# Altium schematic sheet SchematicV2.SchDoc
size A; SheetNumber: 1; SheetTotal: 1
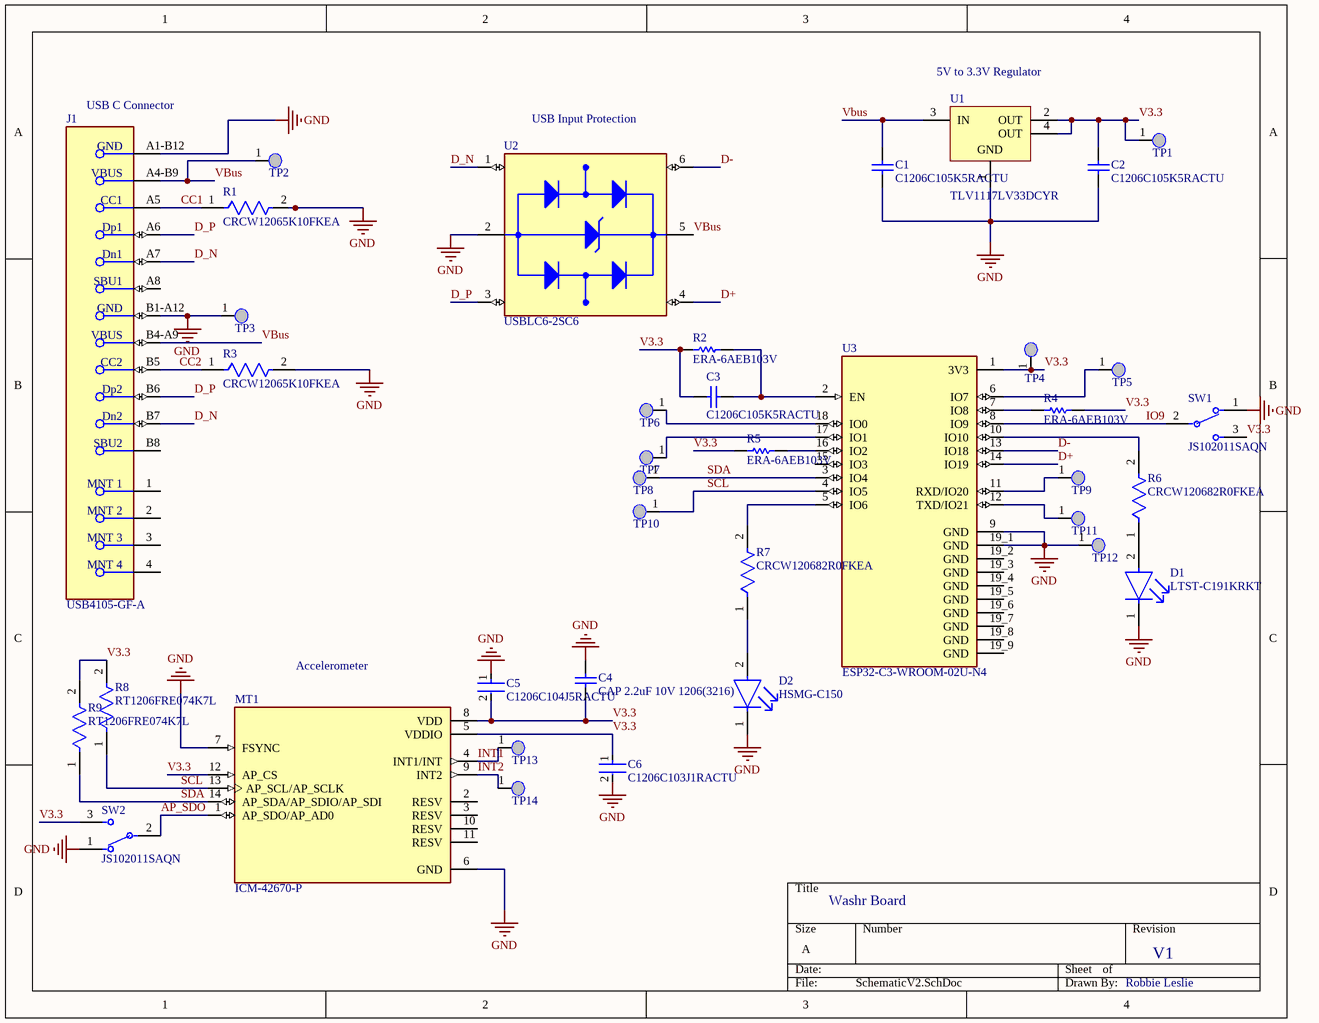
[diagram p0: SchematicV2.SchDoc]

## Parts
C1  C1206C105K5RACTU  [CAPC3216X110X50LL20T25]
C2  C1206C105K5RACTU  [CAPC3216X110X50LL20T25]
C3  C1206C105K5RACTU  [CAPC3216X110X50LL20T25]
C4  CAP 2.2uF 10V 1206(3216)  [CAPC1206(3216)110_M]
C5  C1206C104J5RACTU  [FP-C1206C-EB-MFG]
C6  C1206C103J1RACTU  [FP-C1206C-EB-MFG]
D1  LTST-C191KRKT  [FP-LTST-C191KRKT-MFG]
D2  HSMG-C150  [FP-HSMG-C150-MFG]
J1  USB4105-GF-A  [FP-USB4105-GF-A-MFG]
MT1  ICM-42670-P  [XDCR_ICM-42670-P]
R1  CRCW12065K10FKEA  [FP-CRCW1206-e3-IPC_C]
R2  ERA-6AEB103V  [RESC2013X60X40LL20T25_A]
R3  CRCW12065K10FKEA  [FP-CRCW1206-e3-IPC_C]
R4  ERA-6AEB103V  [RESC2013X60X40LL20T25_A]
R5  ERA-6AEB103V  [RESC2013X60X40LL20T25_A]
R6  CRCW120682R0FKEA  [FP-CRCW1206-e3-IPC_A]
R7  CRCW120682R0FKEA  [FP-CRCW1206-e3-IPC_A]
R8  RT1206FRE074K7L  [FP-RT1206-MFG]
R9  RT1206FRE074K7L  [FP-RT1206-MFG]
SW1  JS102011SAQN  [FP-JS102011SAQN-MFG]
SW2  JS102011SAQN  [FP-JS102011SAQN-MFG]
TP1  Testpin  [PCBComponent_1]  (value not drawn)  (no BOM)
TP2  Testpin  [PCBComponent_1]  (value not drawn)  (no BOM)
TP3  Testpin  [PCBComponent_1]  (value not drawn)  (no BOM)
TP4  Testpin  [PCBComponent_1]  (value not drawn)  (no BOM)
TP5  Testpin  [PCBComponent_1]  (value not drawn)  (no BOM)
TP6  Testpin  [PCBComponent_1]  (value not drawn)  (no BOM)
TP7  Testpin  [PCBComponent_1]  (value not drawn)  (no BOM)
TP8  Testpin  [PCBComponent_1]  (value not drawn)  (no BOM)
TP9  Testpin  [PCBComponent_1]  (value not drawn)  (no BOM)
TP10  Testpin  [PCBComponent_1]  (value not drawn)  (no BOM)
TP11  Testpin  [PCBComponent_1]  (value not drawn)  (no BOM)
TP12  Testpin  [PCBComponent_1]  (value not drawn)  (no BOM)
TP13  Testpin  [PCBComponent_1]  (value not drawn)  (no BOM)
TP14  Testpin  [PCBComponent_1]  (value not drawn)  (no BOM)
U1  TLV1117LV33DCYR  [DCY0004A_N]
U2  USBLC6-2SC6  [SOT95P280X145-6N]
U3  ESP32-C3-WROOM-02U-N4  [XCVR_ESP32-C3-WROOM-02U-N4]

## Nets
GND: C1.1 C2.1 C4.1 C5.1 C6.2 D1.1(C) D2.1(C) J1.A1-B12(GND) J1.B1-A12(GND) MT1.6(GND) MT1.7(FSYNC) R1.2 R3.2 SW1.1 SW2.1 TP3.1(TestPin) TP12.1(TestPin) U1.1(GND) U2.2(GND) U3.9(GND) U3.19_1(GND)
AP_SDO: MT1.1(AP_SDO/AP_AD0) SW2.2(C)
CC1: J1.A5(CC1) R1.1
CC2: J1.B5(CC2) R3.1
D+: U2.4(I/O2_OUT) U3.14(IO19)
D-: U2.6(I/O1_OUT) U3.13(IO18)
D_N: J1.A7(Dn1) J1.B7(Dn2) U2.1(I/O1_IN)
D_P: J1.A6(Dp1) J1.B6(Dp2) U2.3(I/O2_IN)
INT1: MT1.4(INT1/INT) TP13.1(TestPin)
INT2: MT1.9(INT2) TP14.1(TestPin)
IO9: SW1.2(C) U3.8(IO9)
SCL: MT1.13(AP_SCL/AP_SCLK) R8.1 TP10.1(TestPin) U3.4(IO5)
SDA: MT1.14(AP_SDA/AP_SDIO/AP_SDI) R9.1 TP8.1(TestPin) U3.3(IO4)
V3.3: C2.2 C3.2 C4.2 C5.2 C6.1 MT1.5(VDDIO) MT1.8(VDD) MT1.12(AP_CS) R2.1 R4.2 R5.2 R8.2 R9.2 SW1.3 SW2.3 TP1.1(TestPin) TP4.1(TestPin) U1.2(OUT) U1.4(OUT) U3.1(3V3)
VBus: C1.2 J1.A4-B9(VBUS) J1.B4-A9(VBUS) TP2.1(TestPin) U1.3(IN) U2.5(VBUS)
NetC3_1: C3.1 R2.2 U3.2(EN)
NetD1_2: D1.2(A) R6.1
NetD2_2: D2.2(A) R7.1
NetR4_1: R4.1 U3.7(IO8)
NetR5_1: R5.1 U3.16(IO2)
NetR6_2: R6.2 U3.10(IO10)
NetR7_2: R7.2 U3.5(IO6)
NetTP5_1: TP5.1(TestPin) U3.6(IO7)
NetTP6_1: TP6.1(TestPin) U3.18(IO0)
NetTP7_1: TP7.1(TestPin) U3.17(IO1)
NetTP9_1: TP9.1(TestPin) U3.11(RXD/IO20)
NetTP11_1: TP11.1(TestPin) U3.12(TXD/IO21)

Not connected (* = marked no-connect by the designer): J1 1(MNT_1) 2(MNT_2) 3(MNT_3) 4(MNT_4) A8(SBU1) B8(SBU2); MT1 2(RESV) 3(RESV) 10(RESV) 11(RESV); U3 15(IO3) 19_2(GND) 19_3(GND) 19_4(GND) 19_5(GND) 19_6(GND) 19_7(GND) 19_8(GND) 19_9(GND)

## Notes on the sheet
- (near U1) 5V to 3.3V Regulator
- (near J1) USB C Connector
- (near U2) USB Input Protection
- (near MT1) Accelerometer
- Washr Board
- V1
- Robbie Leslie

## Library data of the parts
C1-C3 = CMP-2000-06011-1: Chip Capacitor, 1 uF, +/- 10%, 50 V, -55 to 125 degC, 1206 (3216 Metric), RoHS, Tape and Reel; Manufacturer: Kemet; Case Height: 1mm; Dielectric: X7R; Voltage Rating: 50V; Capacitance: 1uF; Temperature Coefficient / Code: +/-15%; Case Length: 3.2mm; Case Width: 1.6mm; Type: SMDMLCCX7R6.3-250VDCCommericalGrade; Class: Class1; Capacitance - nF: 1000nF; Datasheet URL: http://www.kemet.com/docfinder?Partnumber=C1206C105K5RACTU; Product Category: MultilayerCeramicCapacitorsMLCC-SMD/SMT; Termination Style: SMD/SMT; Dimensions: 1.6mmWx3.2mmLx1mmH; Voltage Rating DC: 50V; Datasheet Version: 02/2016; Packaging: Reel; Brand: Kemet; RoHS: Details; Minimum Operating Temperature: -55C; Operating Temperature Range: -55Cto+125C; Package Reference: 1206; Manufacturer URL: http://www.kemet.com/; Product: GeneralTypeMLCCs; Tolerance: 10%; Package Description: 2-Pin Surface Mount Device, Body 3.2 x 1.6 mm; Mounting Technology: SurfaceMount; Case Code - mm: 3216; Maximum Operating Temperature: +125C; Series: C1206C; Factory Pack Quantity: 2500; Package / Case: 1206(3216metric); Case Code - in: 1206
C4 = CMP-1037-04796-1: CAP 2.2uF 10V ±10% 1206 (3216 Metric) Thickness 1.1mm SMD; Case-EIA: 1206; Tolerance: Â±10%; Case-Metric: 3216; Technology: SMT; Max Thickness: 1.1 mm; Rated Voltage: 10 V; Value: 2.2uF
C5 = CMP-03020-003996-1: Multilayer Ceramic Capacitor, C Series, 0.1 - F, - 5%, X7r, 50 V, 1206 [3216 Metric] Rohs Compliant: Yes; Manufacturer: KEMET; Capacitance: 0.10 μF; Automotive Grade: Grade 0; Voltage Rating: 50 V; Value: 0.10 μF; Description: C1206 0.10 μF X7R 5.00% 50 V; Temperature Coefficient: 15%; Tolerance: 0.05; Height: 0.88mm; Package: C1206C-EB; Octopart: https://octopart.com/c1206c104j5ractu-kemet-110335; Temperature Range Low: -55°C; Temperature: -55°C to +150°C; Manufacturer Part Number: C1206C104J5RACTU; ComponentLink2URL: https://content.kemet.com/datasheets/KEM_C1007_X8R_ULTRA_150C_SMD.pdf; Device Class L3: Ceramic Capacitors; ComponentLink2Description: Datasheet; Automotive: Yes; Material: Ceramic; Category: Cap; Temperature Range High: +150°C; Lead Free: Yes; RoHS: TRUE; Device Class L2: Capacitors; Temperature Characteristic: X7R; Digikey Description: Multilayer Ceramic Capacitor, C Series, 0.1 - F, - 5%, X7r, 50 V, 1206 [3216 Metric] Rohs Compliant: Yes; Mouser Description: Cap Ceramic 0.1uF 50V X7R 5% SMD 1206 125°C Plastic T/R; Ipc Land Pattern Name: CAPC320160X78; Device Class L1: Passive Components
C6 = CMP-03020-003656-1: CAP CER 10000PF 100V X7R 1206; Manufacturer: KEMET; Temperature Coefficient: 15%; Description: C1206 10,000 pF X7R 5.00% 100 V; Capacitance: 10,000 pF; Automotive Grade: Grade 0; Value: 10,000 pF; Material: Ceramic; Tolerance: 0.05; Digikey Description: CAP CER 10000PF 100V X7R 1206; Temperature Range Low: -55°C; Height: 0.88mm; Automotive: Yes; Ipc Land Pattern Name: CAPC320160X78; ComponentLink2URL: https://content.kemet.com/datasheets/KEM_C1007_X8R_ULTRA_150C_SMD.pdf; Device Class L2: Capacitors; Mouser Description: 1206 C 10nF Ceramic Multilayer Capacitor, 100 VDC, +125degC, X7R Dielec, +/-5%; Octopart: https://octopart.com/c1206c103j1ractu-kemet-121270; Category: Cap; Temperature Characteristic: X7R; Voltage Rating: 100 V; Temperature: -55°C to +150°C; Device Class L1: Passive Components; RoHS: TRUE; Device Class L3: Ceramic Capacitors; Manufacturer Part Number: C1206C103J1RACTU; Package: C1206C-EB; Lead Free: Yes; ComponentLink2Description: Datasheet; Temperature Range High: +150°C
D1 = CMP-2000-05199-2: NexarPartId: 549908; Illumination Color: Red; Lens Transparency: Clear; Luminous Intensity: 54mcd; Current: 2A; Forward Current: 20mA; Number of Elements: 1; Power Rating: 75mW; Lens Color: Colorless; Wavelength: 639nm; Viewing Angle: 130°; Voltage: 2V; Dominant Wavelength: 631nm; Reverse Voltage: 5V; Height: 550µm; Length: 1.6mm; Number of Pins: 2; Packaging: Tape and Reel; Mount: Surface Mount; Case Code (Metric): 1608; Radiation Hardening: No; Case Code (Imperial): 0603; Test Current: 20mA; Number of LEDs: 1; Schedule B: 8541402000, 8541402000; Lead Free: Lead Free; Power Dissipation: 75mW; RoHS: Compliant; Forward Voltage: 2V; Lens Style: Clear; Color: Red; Max Operating Temperature: 85°C; Depth: 800µm; Width: 800µm; Min Operating Temperature: -55°C; Case/Package: 0603
D2 = CMP-2000-05061-2: LED GREEN DIFFUSED 1206 SMD; Manufacturer: Broadcom; Led Orientation: Top View; Max Junction Temp: +95°C; Peak Emmision Wavelength: 570nm; Viewing Angle: 170°; Wavelength: 572nm; Reverse Voltage: 5V; Luminous Intensity: 15mcd; Description: Surface Mount Chip LEDs; Forward Voltage: 2.2V; Power Dissipation: 65mW; Forward Current: 20mA; ComponentLink2Description: Datasheet; Lead Free: Yes; Temperature Range Low: -40°C; Package: HSMG-C150; Digikey Description: LED GREEN DIFFUSED 1206 SMD; Mouser Description: LED Uni-Color Green 570nm 2-Pin Chip LED T/R; Manufacturer Part Number: HSMG-C150; Temperature Range High: +85°C; Device Class L1: Optoelectronics; Colour: Green; Category: Diode; Device Class L3: unset; RoHS: TRUE; Height: 1.2mm; ComponentLink2URL: https://docs.broadcom.com/docs/AV02-0551EN; Device Class L2: LEDs; Automotive: No; Ipc Land Pattern Name: DIOCP320160X55; Octopart: https://octopart.com/hsmg-c150-broadcom-71131304; Temperature: -40°C to +85°C
J1 = CMP-245163-000001-1: CONN RCPT USB2.0 TYPEC 5A; Manufacturer: GCT; Voltage Rating: 20V; Is Female: yes; Current Rating: 5/6.25/1.25/0.25A; Number Of Contacts: 16; Conn Orientation: Right Angle; Device Class L1: Connectors; Category: Conn; Lead Free: Yes; RoHS: TRUE; Temperature Range High: +85°C; Digikey Description: CONN RCPT USB2.0 TYPEC 5A; Device Class L3: unset; ComponentLink2Description: Datasheet; Manufacturer Part Number: USB4105-GF-A; Package: 0; Usb Standard: USB 2.0; Device Class L2: USB Connectors; Automotive: No; Temperature Range Low: -40°C; Height: 3.46mm; Temperature: -40°C to +85°C; Contact Material: Gold,Nickel; ComponentLink2URL: https://gct.co/files/drawings/usb4105.pdf; Octopart: https://octopart.com/usb4105-gf-a-gct-106627878
R1 R3 = CMP-1014-00590-3: RES Thick Film, 5.1kΩ, 1%, 0.25W, 100ppm/°C, 1206; Voltage Rating (DC): 200V; Max Power Dissipation: 250mW; Resistance: 5.1kR; Features: Automotive AEC-Q200; Weight: 0.000353oz; Case Code (Imperial): 1206; Case/Package: 1206; Min Operating Temperature: -55°C; Max Operating Temperature: 155°C; Height: 0.55mm; Termination: SMD/SMT; Case Code (Metric): 3216; Power Rating: 250mW; Lead Free: Lead Free; Contact Plating: Tin; Tolerance: 1%; Depth: 1.6mm; Composition: Thick Film; Radiation Hardening: No; Military Standard: Not; Packaging: Tape and Reel; Width: 1.6mm; Voltage Rating: 200V; Package Quantity: 10; Temperature Coefficient: 100ppm/°C; Length: 3.2mm; Number of Terminations: 2
R2 R4 R5 = CMP-2001-00582-2: Metal Film Chip Resistor, High Reliability Type, 0.125 W, +/- 0.1%, -55 to 155 degC, 0805 (2012 Metric), RoHS, Tape and Reel; Voltage Rating: 100V; Power Rating: 125mW(1/8W); Brand: Panasonic; Temperature Coefficient: 25PPM/C; Resistance: 10kOhms; Product Category: ThinFilmResistors-SMD; Datasheet Version: 02/2016; Operating Temperature Range: -55Cto+155C; Length: 2mm; Mounting Technology: SurfaceMount; Manufacturer URL: http://www.panasonic.com/; Width: 1.25mm; Packaging: Reel; Product: ThinFilmResistorsSMD; Package / Case: 0805(2012metric); Termination Style: SMD/SMT; Tolerance: 0.1%; Datasheet URL: https://industrial.panasonic.com/cdbs/www-data/pdf/RDM0000/AOA0000C307.pdf; Package Description: 2-Pin Surface Mount Device, Body 2 x 1.25 mm; Factory Pack Quantity: 5000; Series: ERA-6A; Case Code - mm: 2012; RoHS: Details; Package Reference: 0805; Height: 0.5mm; Manufacturer: Panasonic; Case Code - in: 0805; Type: MetalFilmChipResistors
R6 R7 = CMP-2003-02405-2: RES Thick Film, 82Ω, 1%, 0.25W, 100ppm/°C, 1206; Resistance: 82R; Max Power Dissipation: 250mW; Working Voltage: 200V; Contact Plating: Tin; Tolerance: 1%; Composition: Thick Film; Packaging: Tape and Reel; Lead Free: Lead Free; Number of Terminations: 2; Max Operating Temperature: 155°C; Features: Automotive AEC-Q200; Weight: 0.000353oz; Termination: SMD/SMT; Temperature Coefficient: 100ppm/°C; Package Quantity: 10; Case Code (Metric): 3216; Length: 3.2mm; Width: 0.063inch; Military Standard: Not; Number of Pins: 2; Power Rating: 250mW; Min Operating Temperature: -55°C; Depth: 1.6mm; Radiation Hardening: No; Voltage Rating: 200V; Case Code (Imperial): 1206; Height: 0.55mm; Voltage Rating (DC): 200V; Case/Package: 1206
R8 R9 = CMP-2003-04318-2: RES SMD 4.7K OHM 1% 1/4W 1206; Manufacturer: Yageo; Description: RT1206 4.7KΩ 0.25W 50 ppm/°C 0.02%; Temperature Coefficient: 50 ppm/°C; Value: 4.7KΩ; Power Rating: 0.25W; Voltage Rating: 200V; Tolerance: 0.0002; Temperature Range Low: -55°C; Lead Free: Yes; Height: 0.65mm; Device Class L1: Passive Components; Temperature Range High: +155°C; Composition: Thin Film; Manufacturer Part Number: RT1206FRE074K7L; Device Class L2: Resistors; RoHS: TRUE; Automotive: No; Ipc Land Pattern Name: RESC310160X55; Series: RT; Temperature: -55°C to +155°C; Device Class L3: Chip SMD Resistors; Category: Res; Resistance: 4.7KΩ; Digikey Description: RES SMD 4.7K OHM 1% 1/4W 1206; ComponentLink2Description: Datasheet; Package: RT1206; Footprint Url: http://www.yageo.com/exep/pages/download/literatures/PYu-R_Mount_10.pdf; ComponentLink2URL: http://www.yageo.com/documents/recent/PYu-RT_1-to-0.01_RoHS_L_9.pdf; Mouser Description: Res Thin Film 1206 4.7K Ohm 1% 0.25W(1/4W) ?50ppm/C Molded SMD Paper T/R; Octopart: https://octopart.com/rt1206fre074k7l-yageo-1218966
SW1 SW2 = CMP-2000-06501-2: SWITCH SLIDE SPDT 300MA 6V; Switch Function: On-On; Illumination Type: Non-Illuminated; Switch Travel: 2mm; Contact Resistance: 70mR; Actuator Material: Nylon; Electrical Life: 5000Cycles; Actuator Type: Standard; Max Operating Temperature: 85°C; Housing Material: Nylon; Radiation Hardening: No; Max Voltage Rating (DC): 6V; Package Quantity: 1; Case/Package: 100; Actuator Length: 2mm; Min Operating Temperature: -40°C; Contact Current Rating: 300mA; REACH SVHC: No SVHC; Throw Configuration: SPDT; Packaging: Tape and Reel; Contact Material: Copper Alloy; Max Current Rating: 300mA; Current Rating: 300mA; Mount: Surface Mount; Lead Free: Lead Free; Termination: Gull Wing; Voltage Rating (DC): 6V; Length: 9mm; Orientation: Right Angle; Contact Plating: Silver
TP1-TP14 = Testpin1
U1 = CMP-0395-00503-2: Single Output LDO, 1 A, Fixed 3.3 V Output, 2 to 5.5 V Input, 4-pin SOT-223 (DCY), -40 to 125 degC, Green (RoHS & no Sb/Br); Manufacturer: Texas Instruments; Vout Adj(Min)(V): 3.3; Vdo(Typ)(mV): 1200; Iq(Typ)(mA): 0.05; Accuracy(%): 2; Iout(Max)(A): 1; SubFamily: Single Channel LDO; Vin(Max)(V): 5.5; PackageReference: DCY0004A; PackageDescription: 4-Pin Plastic Small Outline, Body 3.5 x 6.5 mm, Pitch 2.3 mm; Vout Adj(Max)(V): 3.3; Mounting Technology: Surface Mount; ComponentLink2Description: Datasheet; ComponentLink1Description: Manufacturer URL; PartNumber: TLV1117LV33DCYR; ComponentLink3Description: Package Specification; ComponentLink1URL: http://www.ti.com/; ComponentLink2URL: http://www.ti.com/general/docs/lit/getliterature.tsp?genericPartNumber=TLV1117LV33&fileType=pdf; Fixed Output Options(V): 3.3; PackageVersion: 4202506/B; Vin(Min)(V): 2; DatasheetVersion: SBVS160A; Eco-Plan: Green (RoHS & no Sb/Br); ComponentLink3URL: http://www.ti.com/litv/pdf/mpds094a; Code_JEDEC: TO-261
U2 = USBLC6-2SC6: 17V Clamp 5A (8/20Âµs) Ipp Tvs Diode Surface Mount SOT-23-6; MF: STMicroelectronics; Value: *; SnapEDA_Link: https://www.snapeda.com/parts/USBLC6-2SC6/STMicroelectronics/view-part/?ref=snap; Check_prices: https://www.snapeda.com/parts/USBLC6-2SC6/STMicroelectronics/view-part/?ref=eda; Purchase-URL: https://pricing.snapeda.com/search/part/USBLC6-2SC6/?ref=eda; Price: None; Availability: In Stock; Package: SOT-23-6 STMicroelectronics; MP: USBLC6-2SC6; Supplier 1: Future Electronics; Supplier Part Number 1: 7967441
U3 = ESP32-C3-WROOM-02U-N4: Bluetooth, WiFi 802.11b/g/n, Bluetooth v5.0 Transceiver Module 2.4GHz Antenna Not Included, U.FL Surface Mount; MF: Espressif Systems; SnapEDA_Link: https://www.snapeda.com/parts/ESP32-C3-WROOM-02U-N4/Espressif+Systems/view-part/?ref=snap; Package: SMD-19 Espressif Systems; Value: *; MP: ESP32-C3-WROOM-02U-N4; Check_prices: https://www.snapeda.com/parts/ESP32-C3-WROOM-02U-N4/Espressif+Systems/view-part/?ref=eda; Supplier 1: Digikey; Supplier Part Number 1: 1965-ESP32-C3-WROOM-02U-N4CT-ND
MT1 = ICM-42670-P: Package: None; Price: None; Value: *; MP: ICM-42670-P; Availability: Unavailable; Supplier 1: Mouser; Supplier Part Number 1: 410-ICM-42670-P